# Altium schematic sheet Sheet1.SchDoc
size A; SheetNumber: 1; SheetTotal: 1
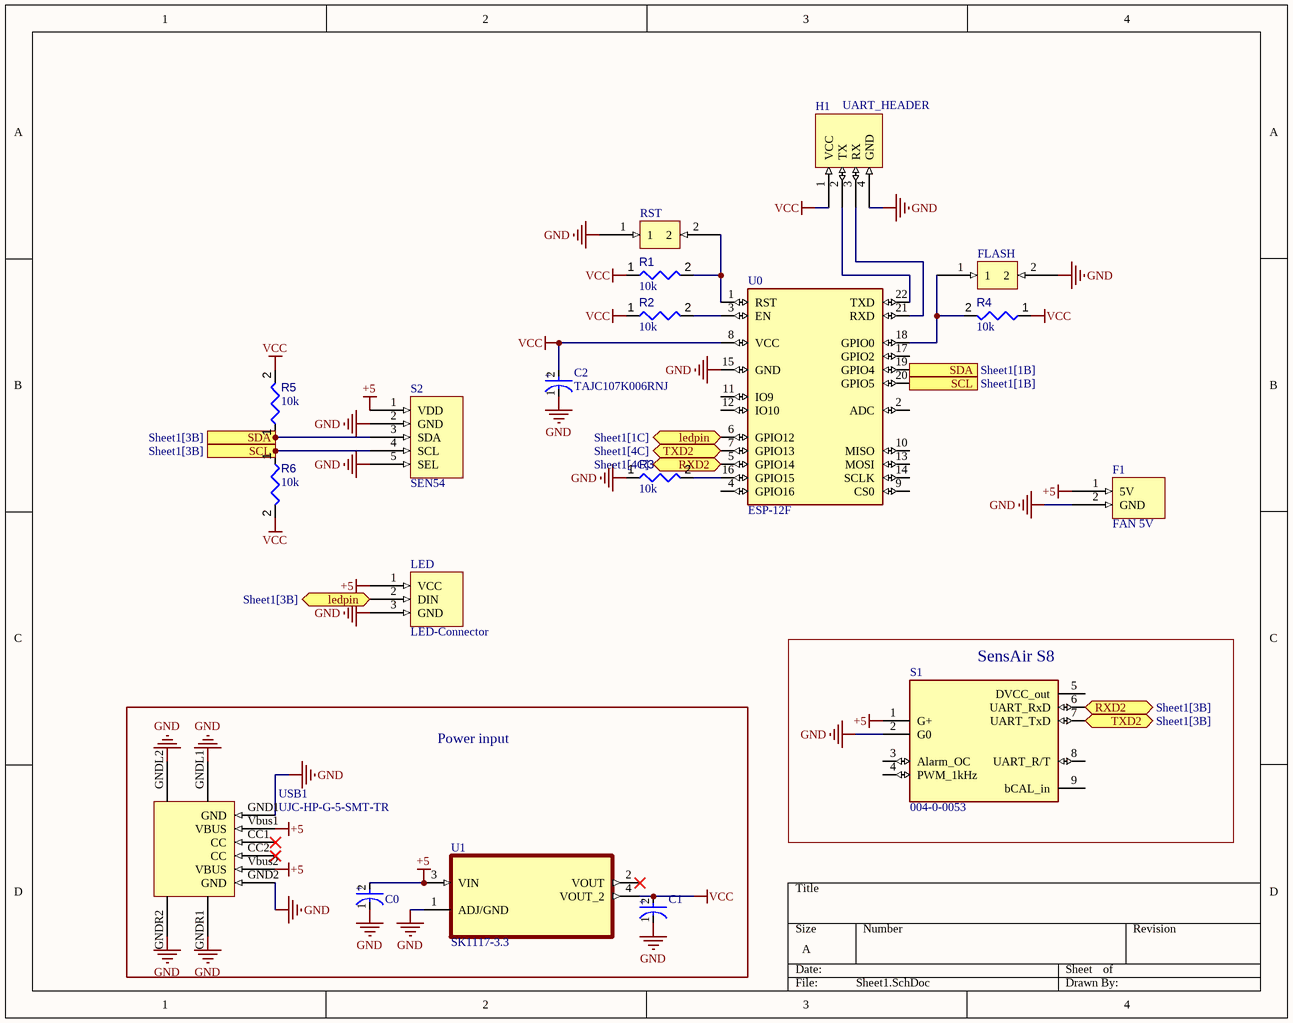
[diagram p0: Sheet1.SchDoc]

## Parts
C0  TAJA106K010RNJ  [FP-TAJA-MFG]  (value not drawn)
C1  TAJA226K010RNJ  [FP-TAJA-MFG]  (value not drawn)
C2  TAJC107K006RNJ  [FP-TAJC-MFG]
F1  FAN 5V  [New footprint 1]
FLASH  ALPSALPINE SKRKAEE020  [Resistor]  (value not drawn)
H1  UART_HEADER  [PRGM_HEADER-Footprint-1]
LED  LED-Connector  [LED-Connector-Footprint-1]
R1  value 10k  [RESC2013X50X35ML15T15]  (hidden comment: Resistor 10k +/-1% 0805 125 mW)
R2  value 10k  [RESC2013X50X35ML15T15]  (hidden comment: Resistor 10k +/-1% 0805 125 mW)
R3  value 10k  [RESC2013X50X35ML15T15]  (hidden comment: Resistor 10k +/-1% 0805 125 mW)
R4  value 10k  [RESC2013X50X35ML15T15]  (hidden comment: Resistor 10k +/-1% 0805 125 mW)
R5  value 10k  [RESC2013X50X35ML15T15]  (hidden comment: Resistor 10k +/-1% 0805 125 mW)
R6  value 10k  [RESC2013X50X35ML15T15]  (hidden comment: Resistor 10k +/-1% 0805 125 mW)
RST  ALPSALPINE SKRKAEE020  [Resistor]  (value not drawn)
S1  004-0-0053  [004-0-0053-Footprint-1]
S2  SEN54  [PRGM_HEADER-Footprint-1]
U0  ESP-12F  [ESP-12F]
U1  SK1117-3.3  [SOT230]
USB1  UJC-HP-G-5-SMT-TR  [New footprint 1]

## Blocks framed on the sheet
SensAir S8: S1
Power input: C0 C1 U1 USB1

## Ports
ledpin (bidir, see Sheet1[1C]), ledpin (bidir, see Sheet1[3B]), RXD2 (bidir, see Sheet1[3B]), RXD2 (bidir, see Sheet1[4C]), SCL (see Sheet1[1B]), SCL (see Sheet1[3B]), SDA (see Sheet1[1B]), SDA (see Sheet1[3B]), TXD2 (bidir, see Sheet1[3B]), TXD2 (bidir, see Sheet1[4C])

## Nets
+5: C0.2(A) F1.1(5V) LED.1(VCC) S1.1(G+) S2.1(VDD) U1.3(VIN) USB1.Vbus1(VBUS) USB1.Vbus2(VBUS)
GND: C0.1(C) C1.1(C) C2.1(C) F1.2(GND) FLASH.2 H1.4(GND) LED.3(GND) R3.1 RST.1 S1.2(G0) S2.2(GND) S2.5(SEL) U0.15(GND) U1.1(ADJ/GND) USB1.GND1(GND) USB1.GND2(GND) USB1.GNDL1(GND) USB1.GNDL2(GND) USB1.GNDR1(GND) USB1.GNDR2(GND)
VCC: C1.2(A) C2.2(A) H1.1(VCC) R1.1 R2.1 R4.1 R5.2 R6.2 U0.8(VCC) U1.4(VOUT_2)
ledpin: LED.2(DIN) U0.6(GPIO12) ; port ledpin
RXD2: S1.6(UART_RxD) U0.5(GPIO14) ; port RXD2
SCL: R6.1 S2.4(SCL) U0.20(GPIO5) ; port SCL
SDA: R5.1 S2.3(SDA) U0.19(GPIO4) ; port SDA
TXD2: S1.7(UART_TxD) U0.7(GPIO13) ; port TXD2
NetFLASH_1: FLASH.1 R4.2 U0.18(GPIO0)
NetH1_2: H1.2(TX) U0.22(TXD)
NetH1_3: H1.3(RX) U0.21(RXD)
NetR1_2: R1.2 RST.2 U0.1(RST)
NetR2_2: R2.2 U0.3(EN)
NetR3_2: R3.2 U0.16(GPIO15)

Not connected (* = marked no-connect by the designer): S1 3(Alarm_OC) 4(PWM_1kHz) 5(DVCC_out) 8(UART_R/T) 9(bCAL_in); U0 2(ADC) 4(GPIO16) 9(CS0) 10(MISO) 11(IO9) 12(IO10) 13(MOSI) 14(SCLK) 17(GPIO2); U1 2(VOUT)*; USB1 CC1(CC)* CC2(CC)*

## Notes on the sheet
- (in symbol CMP-2000-07217-2) +
- (in symbol CMP-2000-07524-2) +
- (in symbol CMP-04424-000198-1) +

## Library data of the parts
C0 = CMP-2000-07217-2: 10uF 10V  ±10% 3Ω 1206  SMD Tantalum Capacitor; ESR (Equivalent Series Resistance): 3R; Dissipation Factor: 6%; Leakage Current: 1uA; Polarity: Polar; Q Factor: 6; Case Code (Imperial): 1206; RoHS Compliant: Yes; Case Code (Metric): 3216; Voltage Rating (DC): 10V; REACH SVHC: No SVHC; Mount: Surface Mount; Package Quantity: 1; Radiation Hardening: No; Width: 1.6mm; Depth: 1.6mm; Packaging: Tape and Reel; Termination: SMD/SMT; Length: 3.2mm; Tolerance: 10%; Features: General Purpose; Capacitance: 10uF; Case/Package: 1206; Max Operating Temperature: 125°C; Voltage Rating: 10V; Height - Seated (Max): 0.071inch; Series: TAJ; Height: 1.6mm; Min Operating Temperature: -55°C; Voltage: 10V; Number of Pins: 2; Construction: Flat; Dielectric Material: Tantalum; Lead Free: Lead Free
C1 = CMP-2000-07524-2: 22uF 10V  ±10% 3Ω 1206  SMD Tantalum Capacitor; ESR (Equivalent Series Resistance): 3R; Leakage Current: 2.2uA; Polarity: Polar; Dissipation Factor: 8%; Termination: SMD/SMT; Voltage Rating (DC): 10V; Capacitance: 22uF; Number of Pins: 2; Length: 3.2mm; Min Operating Temperature: -55°C; Lead Free: Lead Free; Lead Pitch: 1.1mm; Case Code (Metric): 3216; Width: 1.6mm; Tolerance: 10%; Depth: 1.6mm; Max Operating Temperature: 125°C; Construction: Flat; Height: 1.6mm; Voltage: 10V; Packaging: Tape and Reel; Height - Seated (Max): 0.071inch; Mount: Surface Mount; Voltage Rating: 10V; RoHS Compliant: Yes; Case Code (Imperial): 1206; Features: General Purpose; REACH SVHC: No SVHC; Package Quantity: 1; Radiation Hardening: No; Series: TAJ; Dielectric Material: Tantalum; Case/Package: 1206
C2 = CMP-04424-000198-1: 100uF 6.3V  ±10% 900mΩ 2312  SMD Tantalum Capacitor; Dissipation Factor: 6%; Polarity: Polar; Leakage Current: 6.3uA; ESR (Equivalent Series Resistance): 900mR; Package Quantity: 1; Depth: 3.2mm; Case/Package: Molded; Lead Free: Lead Free; Voltage Rating: 6.3V; Series: TAJ; Min Operating Temperature: -55°C; Width: 3.2mm; Max Operating Temperature: 125°C; Features: General Purpose; Mount: Surface Mount; Tolerance: 10%; Termination: SMD/SMT; Length: 6mm; Packaging: Tape and Reel; Case Code (Imperial): 2312; Construction: Flat; Height - Seated (Max): 0.11inch; Radiation Hardening: No; RoHS Compliant: Yes; Height: 2.6mm; Dielectric Material: Tantalum; REACH SVHC: No SVHC; Case Code (Metric): 6032; Capacitance: 100uF
F1 = CMP-001-0000-2: 5v fan
FLASH RST = CMP-011-00013-1: 50mA Brick nogging SPST 12V SMD Tactile Switches ROHS
H1 = CMP-001-0001-4: programming header
LED = CMP-00030-00002-1: Connector for LED
R1-R6 = CMP-009-00018-5: Chip Resistor, 10 KOhm, +/- 1%, 125 mW, -55 to 155 degC, 0805 (2012 Metric); Power: 125mW; Voltage Rating: 150V; Tolerance: 1%; Pins: 2; Min Operating Temperature: -55°C; Case/Package: 0805; Max Operating Temperature: 155°C; RoHS Compliant: True; Mounting Technology: SM
S1 = CMP-010-00025-5: Carbon Dioxide (CO2) Sensor PWM, UART; MF: Senseair North America Inc.; Pin Count: 9; Package: None; Design Item ID: 004-0-0053; Component Type: Standard; MP: 006-0-0002
S2 = CMP-00030-00001-2: PPM particle and voc sensor
U0 = CMP-020-000000-2: WiFi Module; MF: AI-Thinker; MP: ESP-12F; Check_prices: https://www.snapeda.com/parts/ESP-12F/AI-Thinker/view-part/6648243/?ref=eda; Source: ESP-12F.SchLib; Availability: No availability data; Price: None; Value: *; Design Item ID: ESP-12F; Package: Package; SnapEDA_Link: https://www.snapeda.com/parts/ESP-12F/AI-Thinker/view-part/6648243/?ref=snap; Component Type: Standard; Pin Count: 22
U1 = CMP-019-00049-1: 70dB@(120Hz) Fixed 3.3V~3.3V Positive 18V SOT-223 Linear Voltage Regulators (LDO) ROHS; MF: Shikues; Source: SnapEDAsch.SchLib; Design Item ID: SK1117-3.3; Pin Count: 4; Component Type: Standard; Package: SOT-223-4 Texas Instruments; SnapEDA_Link: https://www.snapeda.com/parts/LM1117-3.3/Texas%20Instruments/view-part/549181/?ref=snap; Value: *; Price: None; Availability: Unavailable; MP: SK1117-3.3
USB1 = CMP-002-00071-3: TYPE C, 20 VDC, 3 A, HORIZONTAL,